# EAGLE design ESP8266-PIR (EAGLE 7.6.0)
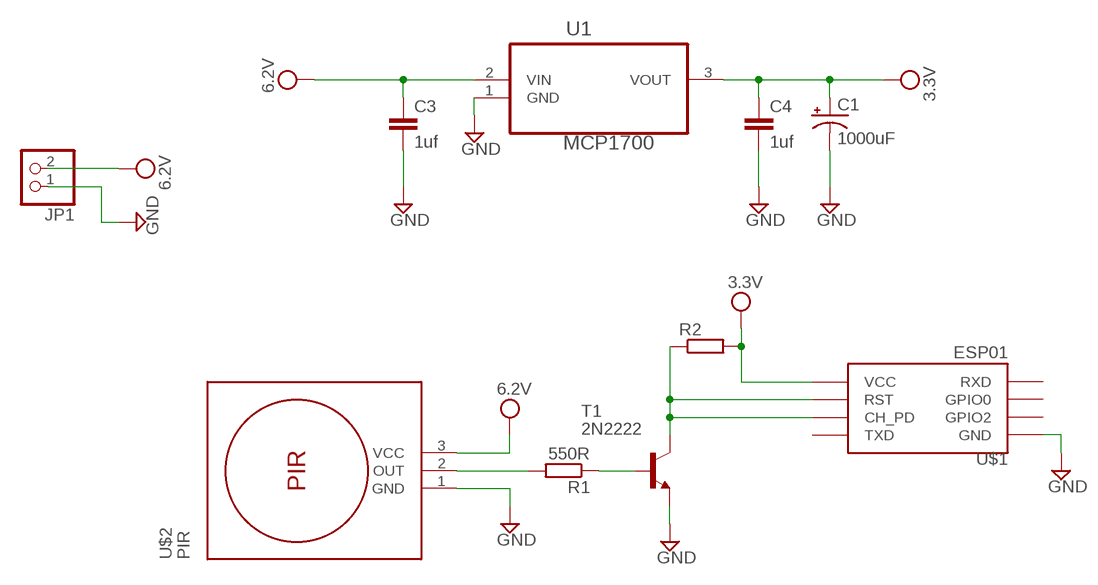
[diagram p0: schematic, sheet 1]

## Parts
C1  1000uF  CAP_POLPTH4  [CPOL-RADIAL-1000UF-25V]
C3  1uf  CAPEZ  [CAP-PTH-SMALLEZ]
C4  1uf  CAPEZ  [CAP-PTH-SMALLEZ]
JP1  PINHD-1X2  [1X02]
R1  550R  R-EU_0207/15  [0207/15]
R2  R-EU_0207/15  [0207/15]
T1  2N2222  [TO18]
U1  MCP1700  MCP1700-3302E/TO  [TO127P254X495-3]
U$1  ESP01  [ESP01]
U$2  PIR  MOTION-PIR-DYP-ME003  [MOTION-PIR-DYP-ME003]

## Nets
3.3V: C1.+ C4.1 R2.2 U1.3(VOUT) U$1.VCC
3.3V_R: R2.1 T1.3(C) U$1.CH_PD U$1.RST
6.2V: C3.1 JP1.2 U1.2(VIN) U$2.3(VCC)
GND: C1.- C3.2 C4.2 JP1.1 T1.1(E) U1.1(GND) U$1.GND U$2.1(GND)
OUT: R1.2 U$2.2(OUT)
OUT_R: R1.1 T1.2(B)
Unconnected: U$1.GPIO0 U$1.GPIO2 U$1.RX(RXD) U$1.TX(TXD)

## Library data of the parts
C1 = SparkFun-Capacitors:CAP_POL: Capacitor Polarized These are standard SMD and PTH capacitors. Normally 10uF, 47uF, and 100uF in electrolytic and tantalum varieties. Always verify the external diameter of the through hole cap, it varies with capacity, voltage, and manufacturer. The EIA devices should be standard.
C3 C4 = SparkFun-Capacitors:CAP: Capacitor Standard 0603 ceramic capacitor, and 0.1" leaded capacitor.
JP1 = pinhead:PINHD-1X2: PIN HEADER
R1 R2 = resistor:R-EU_: RESISTOR, European symbol
T1 = transistor:2N2222: NPN TRANSISTOR
U1 = mcp1700:MCP1700-3302E/TO: IC, Low Quiescent Current LDO,3.3V,TO-92; MPN: MCP1700-3302E/TO; OC_FARNELL: 1296588; OC_NEWARK: 88H9804; PACKAGE: TO-92; SUPPLIER: Microchip
U$1 = esp8266modules:ESP01: ESP8266 Wifi module 01
U$2 = diy-modules:MOTION-PIR-DYP-ME003: PIR Motion Sensor Module DYP-ME003 based on BISS0001 pyroelectic detector

## Board
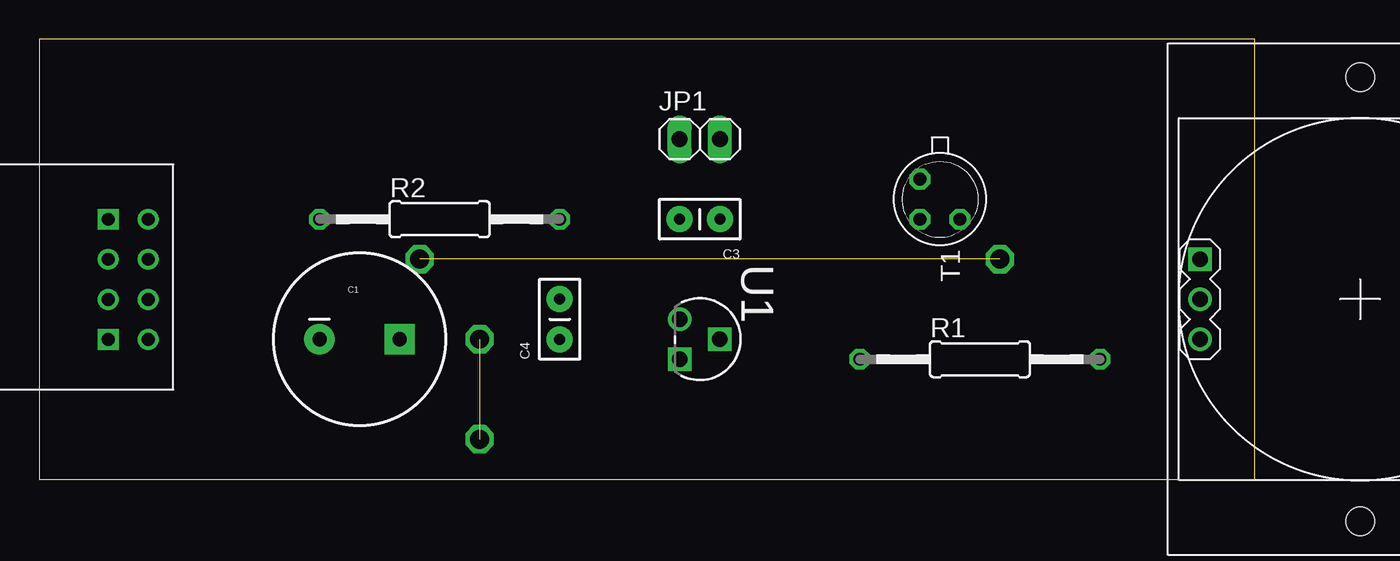
[diagram p1: board, top side]
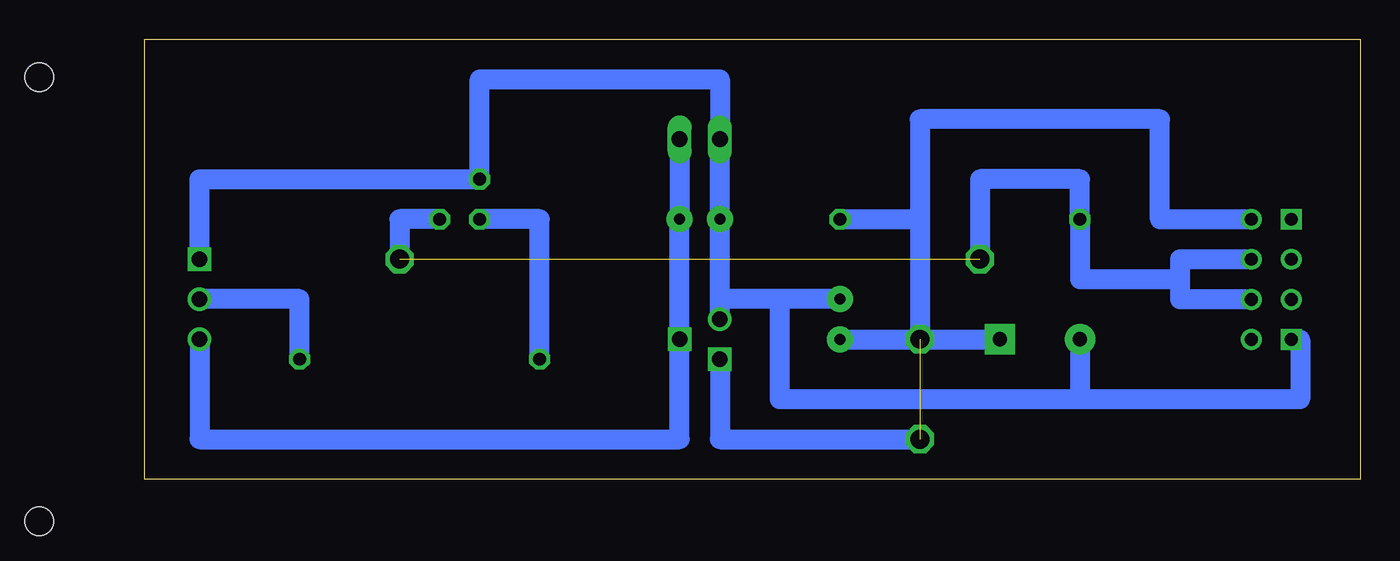
[diagram p2: board, bottom side, seen from below]

Size 77.14 x 27.93 mm. Coordinates in mm from the lower left corner, seen from the top.
Outline: 0,0 77.14,0 77.14,27.93 0,27.93 0,0
Copper layers (1*16): Top 0.035mm / dielectric 1.5mm / Bottom 0.035mm
Design rules "default": minimum track width 10mil, minimum drill 24mil, track to track 8mil, track to pad 8mil, pad to pad 8mil, via to via 8mil, smd to smd 8mil, copper to edge 40mil, drill to drill 8mil, minimum pad ring 10mil, minimum via ring 8mil, stop-mask expansion 4mil, vias tented up to drill 0mil, thermal gap 10mil

### Footprints (pad centres in the part's own frame; a part is rotated, then mirrored left to right if it is on the bottom)
CPOL-RADIAL-1000UF-25V = drill 0.9 pad 1.93 square: + 2.54,0 | drill 0.9 pad 1.93: - -2.54,0
CAP-PTH-SMALLEZ = drill 0.7 pad 1.651: 1 0,0; 2 2.54,0
1X02 = drill 1.016 long: 1 -1.27,0; 2 1.27,0
0207/15 = drill 0.813 octagon: 1 -7.62,0; 2 7.62,0
TO18 = drill 0.813 octagon: 1 -1.27,-1.27; 2 1.27,-1.27; 3 1.27,1.27
TO127P254X495-3 = drill 0.991: 1 -2.54,-2.54 | drill 0.991 square: 2 -1.27,0; 3 0,-2.54
ESP01 = drill 0.8: CH_PD -1.285,-8.178; GPIO0 1.255,-5.638; GPIO2 -1.285,-5.638; RST 1.255,-8.178; TX -3.825,-8.178; VCC 3.795,-8.178 | drill 0.8 square: GND -3.825,-5.638; RX 3.795,-5.638
MOTION-PIR-DYP-ME003 = drill 1 square: 1 -2.54,-10.16 | drill 1: 2 0,-10.16; 3 2.54,-10.16 | hole 1.8: -14.1,0; 14.1,0

### Placement (x,y rotation side)
C1  20.32,8.89 0 top
C3  43.18,16.51 180 top
C4  33.02,8.89 90 top
JP1  41.91,21.59 0 top
R1  59.69,7.62 0 top
R2  25.4,16.51 0 top
T1  57.15,17.78 270 top
U1  43.18,7.62 270 top
U$1  -1.27,12.7 90 top
U$2  83.82,11.43 270 top

### Tracks (layer width: path | path; a pad name or v marks a point on that pad's centre or on a via)
3.3V  (via drill 1.2)  (1 unrouted)
  Bottom 1.27: C4.1 v27.94,8.89 | v27.94,8.89 C1.+ | R2.2 27.94,16.51 | 27.94,16.51 v27.94,8.89 | U1.3 40.64,2.54 v27.94,2.54 | U$1.VCC 12.7,16.49 12.7,22.86 27.94,22.86 27.94,16.51
3.3V_R  (via drill 1.2)  (1 unrouted)
  Bottom 1.27: 11.43,12.7 17.78,12.7 R2.1 17.78,19.05 24.13,19.05 v24.13,13.97 | 11.43,12.7 11.43,11.43 U$1.CH_PD | U$1.RST 11.43,13.95 11.43,12.7 | T1.3 60.96,16.51 v60.96,13.97
6.2V
  Bottom 1.27: JP1.2 C3.1 U1.2 43.18,2.54 73.66,2.54 U$2.3
GND
  Bottom 1.27: U$1.GND 3.81,8.88 3.81,5.08 17.78,5.08 | C1.- 17.78,5.08 | 17.78,5.08 36.83,5.08 36.83,11.43 | C4.2 36.83,11.43 | 36.83,11.43 40.64,11.43 | U1.1 40.64,11.43 | 40.64,11.43 C3.2 JP1.1 40.64,25.4 55.88,25.4 T1.1 73.66,19.05 U$2.1
OUT
  Bottom 1.27: R1.2 67.31,11.43 U$2.2
OUT_R
  Bottom 1.27: R1.1 52.07,16.51 T1.2